# EAGLE schematic POD_box (EAGLE 4.13)
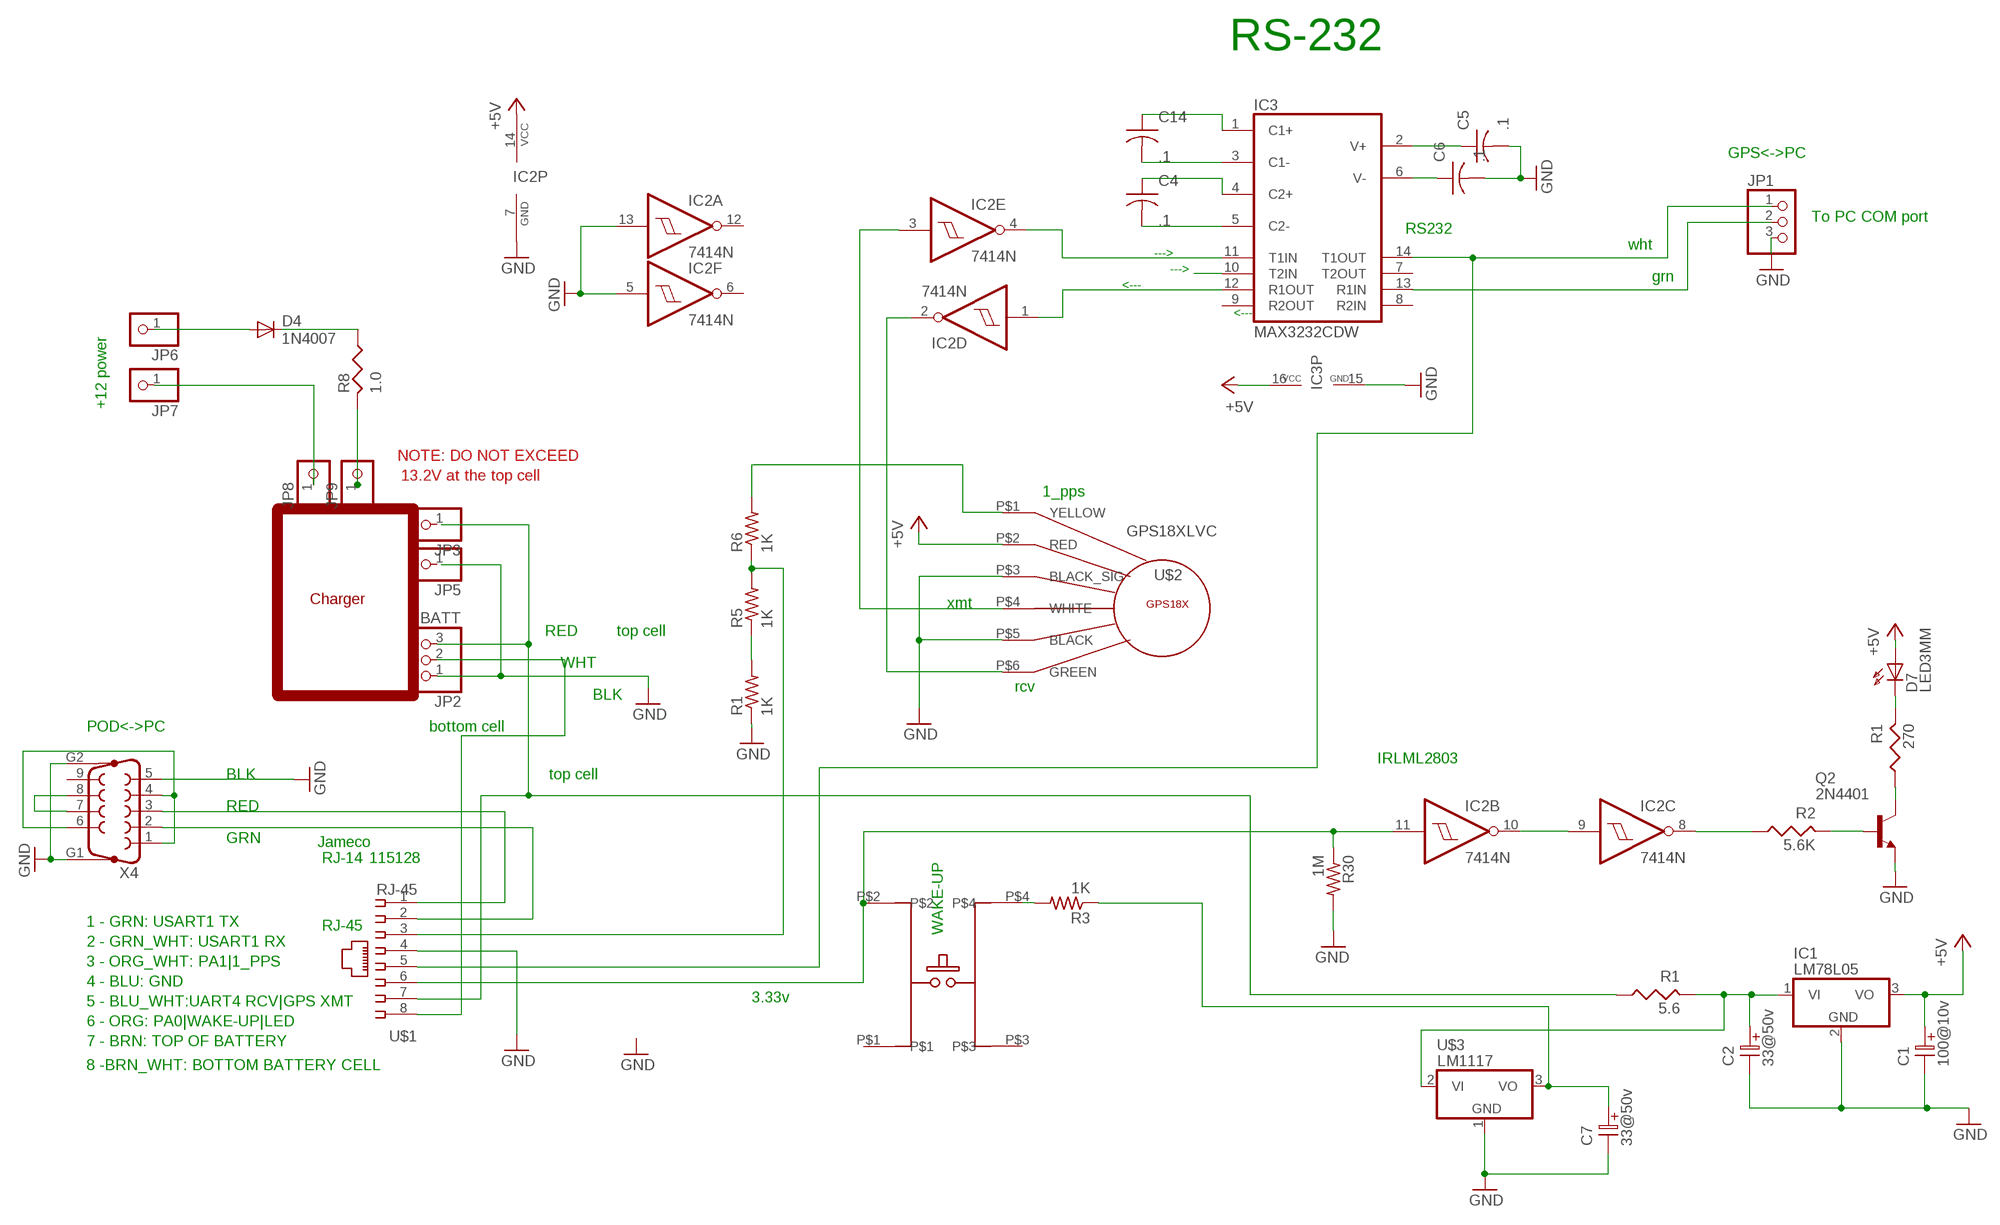
[diagram p0: schematic, sheet 1]

## Parts
5.6  R1  RESUS-S2,5  [RS-2,5]
5.6K  R2  RESUS-S2,5  [RS-2,5]
270  R1  RESUS-S2,5  [RS-2,5]
C1  100@10v  ELC-2,5L  [ES-2,5L]
C2  33@50v  ELC-2,5L  [ES-2,5L]
C4  .1  SMT0805  [SMT0805]
C5  .1  SMT0805  [SMT0805]
C6  .1  SMT0805  [SMT0805]
C7  33@50v  ELC-2,5  [ES-2,5]
C14  .1  SMT0805  [SMT0805]
D4  1N4007  1N4004_VERT  [DO41-10_VERT]
D7  LED3MM  [LED3MM]
IC1  LM78L05  7805T  [TO220H]
IC2  7414N  [DIL14]
IC3  MAX3232CDW  MAX232ECWE  [SO16L]
JP1  PINHD-1X3  [1X03]
JP2  BATT  PINHD-1X3  [1X03]
JP3  PINHD-1X1  [1X01]
JP5  PINHD-1X1  [1X01]
JP6  PINHD-1X1  [1X01]
JP7  PINHD-1X1  [1X01]
JP8  PINHD-1X1  [1X01]
JP9  PINHD-1X1  [1X01]
Q2  2N4401  2N4416  [TO92]
R1  1K  R-US_R0603  [R0603]
R3  1K  R-US_R0603  [R0603]
R5  1K  R-US_R0603  [R0603]
R6  1K  R-US_R0603  [R0603]
R8  1.0  RESUS-S2,5  [RS-2,5]
R30  1M  R-US_M0805  [M0805]
SW100  E-SWITCH  [E-SWITCH]
U$1  RJ-45  8P8CJACK  [8P8C]
U$2  GPS18XLVC  [GPS18XLVC]
U$3  LM1117  [TO220H]
X4  F09VP  [F09VP]

## Nets
1K_DIVIDER_WAKE-UP_HI-SIDE: R3.2 SW100.P$4
2N4401_BASE: 5.6K.2 Q2.2(B)
2N4402_COLLECTOR: 270.1 Q2.1(C)
232_T2IN: IC3.10(T2IN)
+5V: C1.1 D7.A IC1.3(VO) IC2.14(P:VCC) IC3.16(VCC) U$2.P$2(RED)
C2+: C4.P$1 IC3.4(C2+)
C2-: C4.P$2 IC3.5(C2-)
C!+: C14.P$1 IC3.1(C1+)
C!-: C14.P$2 IC3.3(C1-)
CHARGER_INPUT: JP9.1 R8.2
DIODE+VIN: D4.C R8.1
GND: C1.2 C2.2 C5.P$2 C6.P$2 C7.2 IC1.2(GND) IC2.5(F:I) IC2.7(P:GND) IC2.13(A:I) IC3.15(GND) JP1.3 JP2.1 Q2.3(E) R1.1 R30.2 U$1.4 U$2.P$3(BLACK_SIG) U$2.P$5(BLACK) U$3.1(GND) X4.5 X4.G1 X4.G2
GPS_1_PPS_5V: R6.2 U$2.P$1(YELLOW)
GPS_RCV: IC2.2(D:O) U$2.P$6(GREEN)
GPS_XMT: IC2.3(E:I) U$2.P$4(WHITE)
LED_2N4401_SIDE: 270.2 D7.K(C)
LED_INVERTER-INVERTER: IC2.9(C:I) IC2.10(B:O)
LED_INVERTER_OUTPUT: 5.6K.1 IC2.8(C:O)
LM7805_INPUT: 5.6.2 C2.1 IC1.1(VI) U$3.2(VI)
MORE_RS232_STUFF: X4.7 X4.8
N$1: R1.2 R5.1
N$2: IC3.13(R1IN) JP1.2
N$3: C7.1 R3.1 U$3.3(VO)
N$5: JP7.1 JP8.1
N$6: D4.A JP6.1
PA1|GPS_1_PPS_3.3V: R5.2 R6.1 U$1.3
PA1|RJ-45_SPARE: IC2.11(B:I) R30.1 SW100.P$2 U$1.6
PB1_ADC8|BOTTOM_CELL: JP2.2 U$1.8
RS232_R1IN_USART1_RX: U$1.1 X4.3
RS-232_STUFF: X4.1 X4.4 X4.6
T1OUT_USART1_TX: U$1.2 X4.2
TOP_CELL_RAW: 5.6.1 JP2.3 U$1.7
TTY_S0_RX: IC2.1(D:I) IC3.12(R1OUT)
TTY_S0_TX: IC2.4(E:O) IC3.11(T1IN)
UART4_RCV|GPS_XMIT: IC3.14(T1OUT) JP1.1 U$1.5
V+: C5.P$1 IC3.2(V+)
V-: C6.P$1 IC3.6(V-)
Unconnected: IC2.6(F:O) IC2.12(A:O) IC3.7(T2OUT) IC3.8(R2IN) IC3.9(R2OUT) JP3.1 JP5.1 SW100.P$1 SW100.P$3 X4.9

## Notes on the sheet
- RS-232
- GPS<->PC
- To PC COM port
- RS232
- wht
- --->
- --->
- grn
- <---
- <---
- +12 power
- NOTE: DO NOT EXCEED
- 13.2V at the top cell
- 1_pps
- Charger | xmt
- RED | top cell
- WHT
- rcv
- BLK
- POD<->PC | bottom cell
- IRLML2803
- BLK | top cell
- RED
- GRN | Jameco
- RJ-14 | 115128
- 1 - GRN: USART1 TX | RJ-45
- WAKE-UP
- 2 - GRN_WHT: USART1 RX
- 3 - ORG_WHT: PA1|1_PPS
- 4 - BLU: GND
- 5 - BLU_WHT:UART4 RCV|GPS XMT | 3.33v
- 6 - ORG: PA0|WAKE-UP|LED
- 7 - BRN: TOP OF BATTERY
- 8 -BRN_WHT: BOTTOM BATTERY CELL

## Library data of the parts
5.6 5.6K 270 R8 = DEH:RESUS-S2,5
C1 C2 = DEH:ELC-2,5L
C4-C6 C14 = DEH:SMT0805
C7 = DEH:ELC-2,5
D4 = diode:1N4004_VERT
D7 = led:LED3MM: LED 3 mm, round
IC1 = linear:78*: Positive VOLTAGE REGULATOR
IC2 = 74xx-us:74*14: Hex schmitt trigger INVERTER
IC3 = maxim:MAX232ECWE: RS232 TRANSEIVER
JP1 JP2 = pinhead:PINHD-1X3: PIN HEADER
JP3 JP5-JP9 = pinhead:PINHD-1X1: PIN HEADER
Q2 = transistor-npn:2N4416: NPN Transistor
R1 R3 R5 R6 R30 = rcl:R-US_: RESISTOR, American symbol
SW100 = switch-misc:E-SWITCH
U$1 = con-amp:8P8CJACK
U$2 = DEH:GPS18XLVC
U$3 = linear:LM1117
X4 = con-subd:F09VP: SUB-D

## Net classes
0 default: width 0.406 mm, clearance 0.711 mm